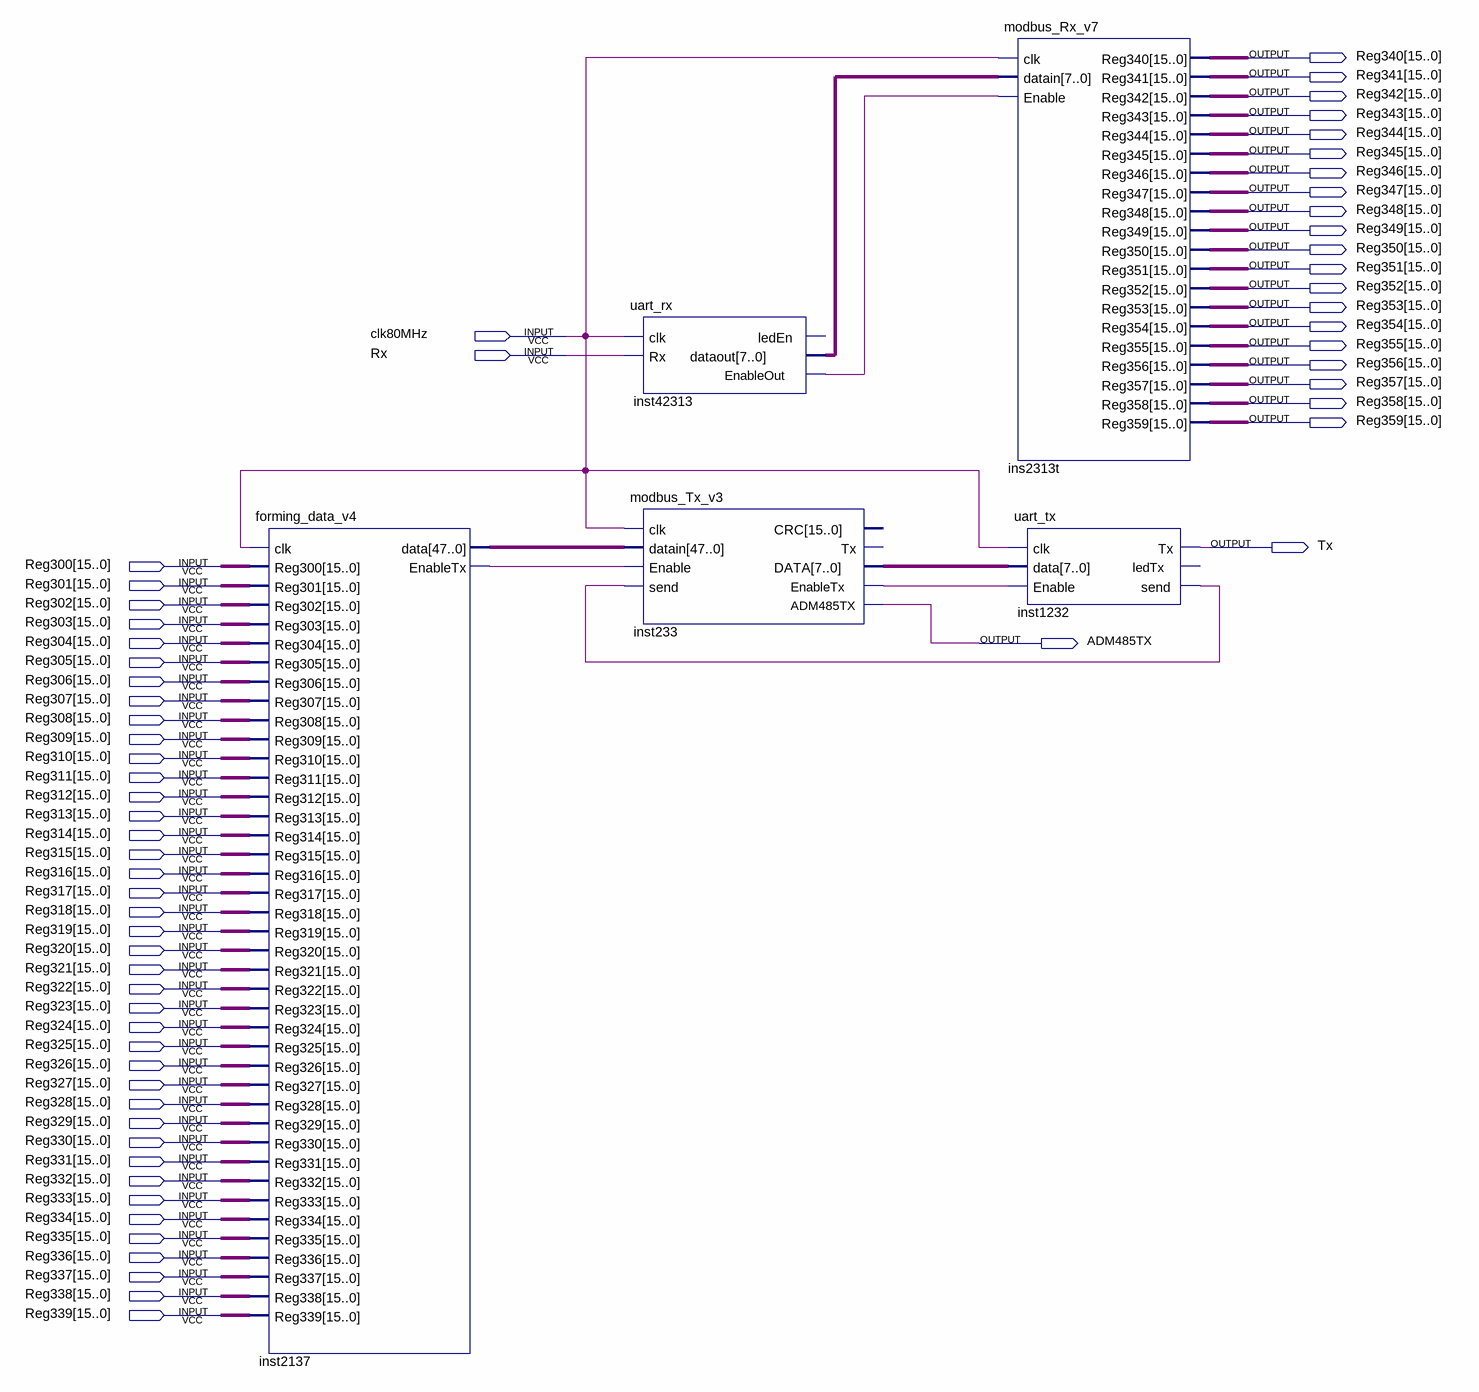
[diagram p0: schematic sheet]
// Quartus schematic SP270ModbusMasterRTU.bdf as structural Verilog: 5 symbols, 64 pins
module SP270ModbusMasterRTU (
  input  clk80MHz,
  input  Rx,
  input  [15:0] Reg300,
  input  [15:0] Reg301,
  input  [15:0] Reg302,
  input  [15:0] Reg303,
  input  [15:0] Reg304,
  input  [15:0] Reg305,
  input  [15:0] Reg306,
  input  [15:0] Reg307,
  input  [15:0] Reg308,
  input  [15:0] Reg309,
  input  [15:0] Reg310,
  input  [15:0] Reg311,
  input  [15:0] Reg312,
  input  [15:0] Reg313,
  input  [15:0] Reg314,
  input  [15:0] Reg315,
  input  [15:0] Reg316,
  input  [15:0] Reg317,
  input  [15:0] Reg318,
  input  [15:0] Reg319,
  input  [15:0] Reg320,
  input  [15:0] Reg321,
  input  [15:0] Reg322,
  input  [15:0] Reg323,
  input  [15:0] Reg324,
  input  [15:0] Reg325,
  input  [15:0] Reg326,
  input  [15:0] Reg327,
  input  [15:0] Reg328,
  input  [15:0] Reg329,
  input  [15:0] Reg330,
  input  [15:0] Reg331,
  input  [15:0] Reg332,
  input  [15:0] Reg333,
  input  [15:0] Reg334,
  input  [15:0] Reg335,
  input  [15:0] Reg336,
  input  [15:0] Reg337,
  input  [15:0] Reg338,
  input  [15:0] Reg339,
  output [15:0] Reg340,
  output [15:0] Reg341,
  output [15:0] Reg342,
  output [15:0] Reg343,
  output [15:0] Reg344,
  output [15:0] Reg345,
  output [15:0] Reg346,
  output [15:0] Reg347,
  output [15:0] Reg348,
  output [15:0] Reg349,
  output [15:0] Reg350,
  output [15:0] Reg351,
  output [15:0] Reg352,
  output [15:0] Reg353,
  output [15:0] Reg354,
  output [15:0] Reg355,
  output [15:0] Reg356,
  output [15:0] Reg357,
  output [15:0] Reg358,
  output [15:0] Reg359,
  output Tx,
  output ADM485TX
);

  wire inst233_enabletx, inst1232_send, inst2137_enabletx, inst42313_enableout;
  wire [7:0] inst233_data, inst42313_dataout;
  wire [47:0] inst2137_data;

  forming_data_v4 inst2137 (
    .clk(clk80MHz), .Reg300(Reg300), .Reg301(Reg301), .Reg302(Reg302), .Reg303(Reg303), .Reg304(Reg304),
    .Reg305(Reg305), .Reg306(Reg306), .Reg307(Reg307), .Reg308(Reg308), .Reg309(Reg309), .Reg310(Reg310),
    .Reg311(Reg311), .Reg312(Reg312), .Reg313(Reg313), .Reg314(Reg314), .Reg315(Reg315), .Reg316(Reg316),
    .Reg317(Reg317), .Reg318(Reg318), .Reg319(Reg319), .Reg320(Reg320), .Reg321(Reg321), .Reg322(Reg322),
    .Reg323(Reg323), .Reg324(Reg324), .Reg325(Reg325), .Reg326(Reg326), .Reg327(Reg327), .Reg328(Reg328),
    .Reg329(Reg329), .Reg330(Reg330), .Reg331(Reg331), .Reg332(Reg332), .Reg333(Reg333), .Reg334(Reg334),
    .Reg335(Reg335), .Reg336(Reg336), .Reg337(Reg337), .Reg338(Reg338), .Reg339(Reg339),
    .data(inst2137_data), .EnableTx(inst2137_enabletx));
  uart_rx inst42313 (
    .clk(clk80MHz), .Rx(Rx), .dataout(inst42313_dataout), .EnableOut(inst42313_enableout));  // open: ledEn
  modbus_Tx_v3 inst233 (
    .clk(clk80MHz), .datain(inst2137_data), .Enable(inst2137_enabletx), .send(inst1232_send),
    .DATA(inst233_data), .EnableTx(inst233_enabletx), .ADM485TX(ADM485TX));  // open: CRC, Tx
  modbus_Rx_v7 ins2313t (
    .clk(clk80MHz), .datain(inst42313_dataout), .Enable(inst42313_enableout), .Reg340(Reg340),
    .Reg341(Reg341), .Reg342(Reg342), .Reg343(Reg343), .Reg344(Reg344), .Reg345(Reg345), .Reg346(Reg346),
    .Reg347(Reg347), .Reg348(Reg348), .Reg349(Reg349), .Reg350(Reg350), .Reg351(Reg351), .Reg352(Reg352),
    .Reg353(Reg353), .Reg354(Reg354), .Reg355(Reg355), .Reg356(Reg356), .Reg357(Reg357), .Reg358(Reg358),
    .Reg359(Reg359));
  uart_tx inst1232 (
    .clk(clk80MHz), .data(inst233_data), .Enable(inst233_enabletx), .Tx(Tx), .send(inst1232_send));  // open: ledTx
endmodule
